# Altium project buck_chw_v3.0.PrjPcb
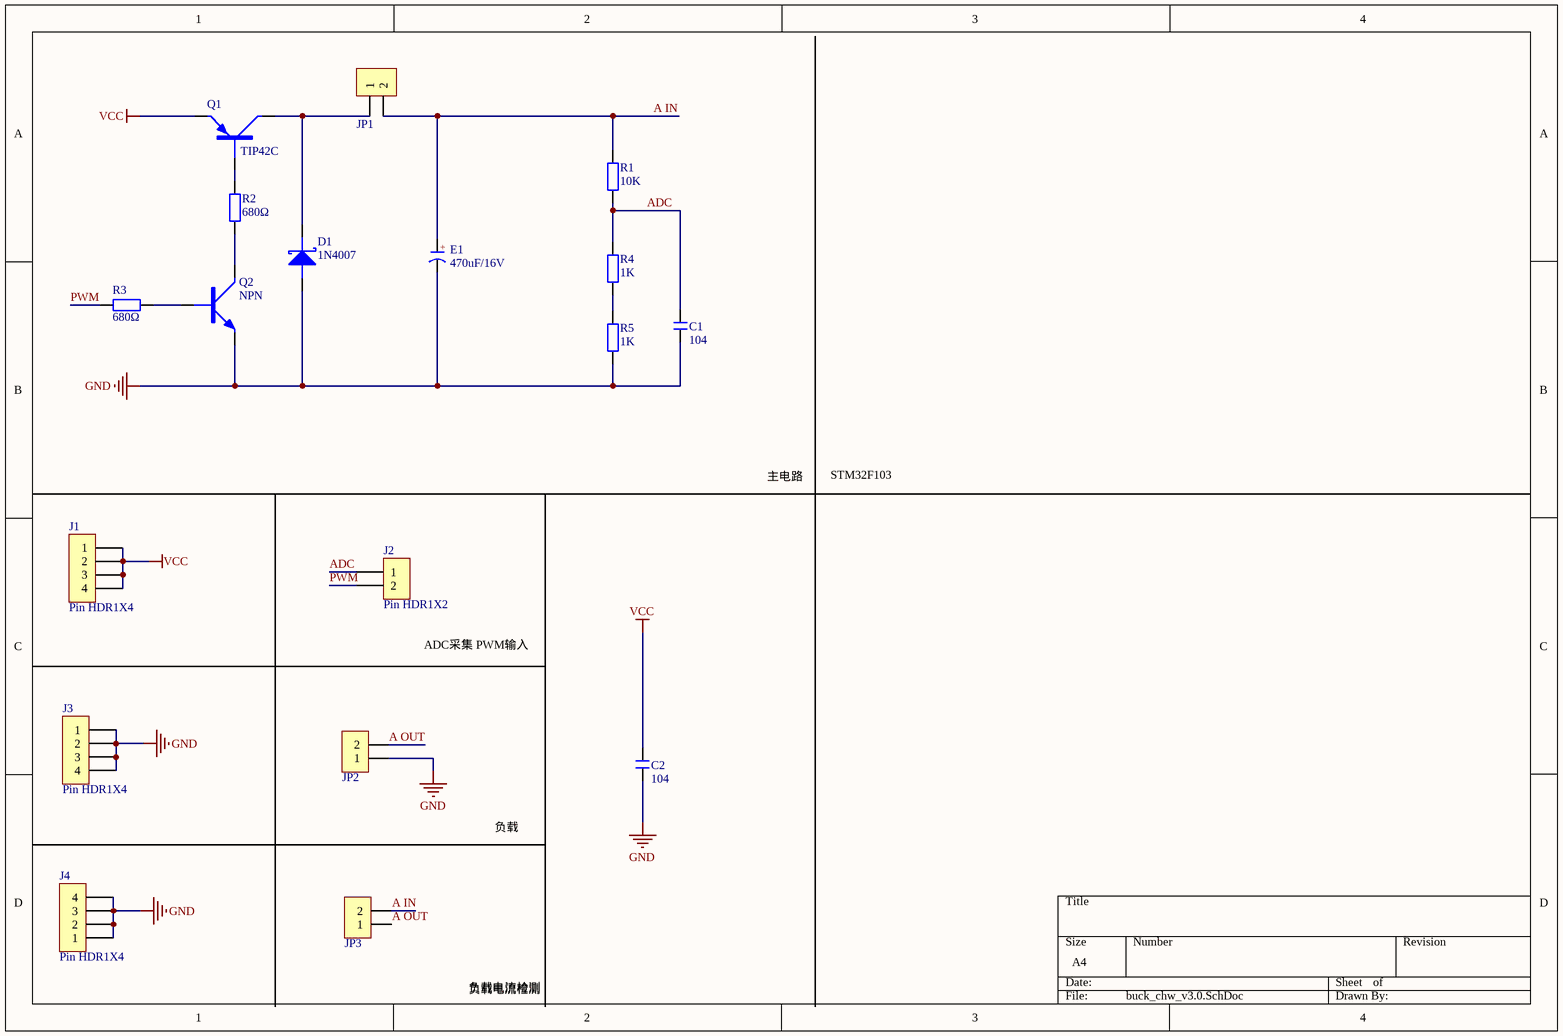
[diagram p0: buck_chw_v3.0.SchDoc]
1 sheet, 18 parts. Net scope: global (net labels, ports and power ports of the same name join across sheets).
Board file: buck_chw_v3.0.PcbDoc

## Sheet buck_chw_v3.0.SchDoc
size A4

### Parts
C1  104  [CC 1.8*3.6]
C2  104  [CC 1.8*3.6]
D1  1N4007  [DO-15]
E1  470uF/16V  [CAP 1.5*4*8]
J1  Pin HDR1X4  [Pin HDR1X4/2.54mm-S]
J2  Pin HDR1X2  [Pin HDR1X2/2.54mm-S]
J3  Pin HDR1X4  [Pin HDR1X4/2.54mm-S]
J4  Pin HDR1X4  [Pin HDR1X4/2.54mm-S]
JP1  HDR-1X2  [KF301-5.0-2P]  (value not drawn)
JP2  HDR-1X2  [KF301-5.0-2P]  (value not drawn)
JP3  HDR-1X2  [KF301-5.0-2P]  (value not drawn)
Q1  TIP42C  [Fe-HDR1X3/2.54-S]
Q2  NPN  [HDR2.54-Y-LI-3P]
R1  10K  [RS 1/4W]
R2  680Ω  [RS 1/4W]
R3  680Ω  [RS 1/4W]
R4  1K  [RS 1/4W]
R5  1K  [RS 1/4W]

### Nets
GND: C1.2 C2.2 D1.A E1.2(K) J3.1 J3.2 J3.3 J3.4 J4.1 J4.2 J4.3 J4.4 JP2.1 Q2.E R5.1
VCC: C2.1 J1.1 J1.2 J1.3 J1.4 Q1.E
A IN: E1.1(A) JP1.2 JP3.2 R1.2
A OUT: JP2.2 JP3.1
ADC: C1.1 J2.1 R1.1 R4.2
PWM: J2.2 R3.1
NetD1_K: D1.K JP1.1 Q1.C
NetQ1_B: Q1.B R2.2
NetQ2_B: Q2.B R3.2
NetQ2_C: Q2.C R2.1
NetR4_1: R4.1 R5.2

### Notes on the sheet
- 主电路
- STM32F103
- ADC采集 PWM输入
- 负载
- 负载电流检测
- (in symbol C-CAP) +

### Library data of the parts
C1 C2 = C-CC: 直插瓷片电容; 版权归属: 源创客; BOM名称: 直插瓷片电容; 学习资源: www.ooocke.com
D1 = DIODE SCHOTTKY: 肖特基二极管
E1 = C-CAP: 直插电解电容; 版权归属: 源创客; BOM名称: 直插电解电容; 学习资源: www.ooocke.com
JP1-JP3 = Header 2: 2P接插件; 版权归属: 源创客; BOM名称: 2P接插件; 学习资源: www.ooocke.com
Q1 = PNP: PNP三极管; pin to pad: B>1 C>2 E>3
Q2 = NPN: NPN三极管; pin to pad: B>2 C>3 E>1
R1-R5 = R-CRR: 直插色环电阻; BOM名称: 色环电阻; 版权归属: 源创客; 学习资源: www.ooocke.com